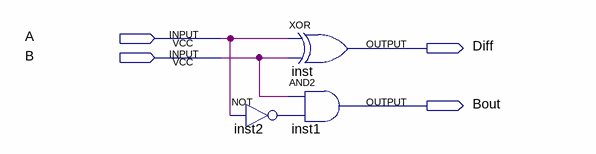
[diagram p0: schematic sheet]
// Quartus schematic Half-Subtractor.bdf as structural Verilog: 3 symbols, 4 pins
module \Half-Subtractor  (
  input  A,
  input  B,
  output Diff,
  output Bout
);

  wire inst2_out;

  xor inst (Diff, A, B);
  and inst1 (Bout, B, inst2_out);
  not inst2 (inst2_out, A);
endmodule
